# Altium schematic sheet FMB-MCU.SchDoc
size A3
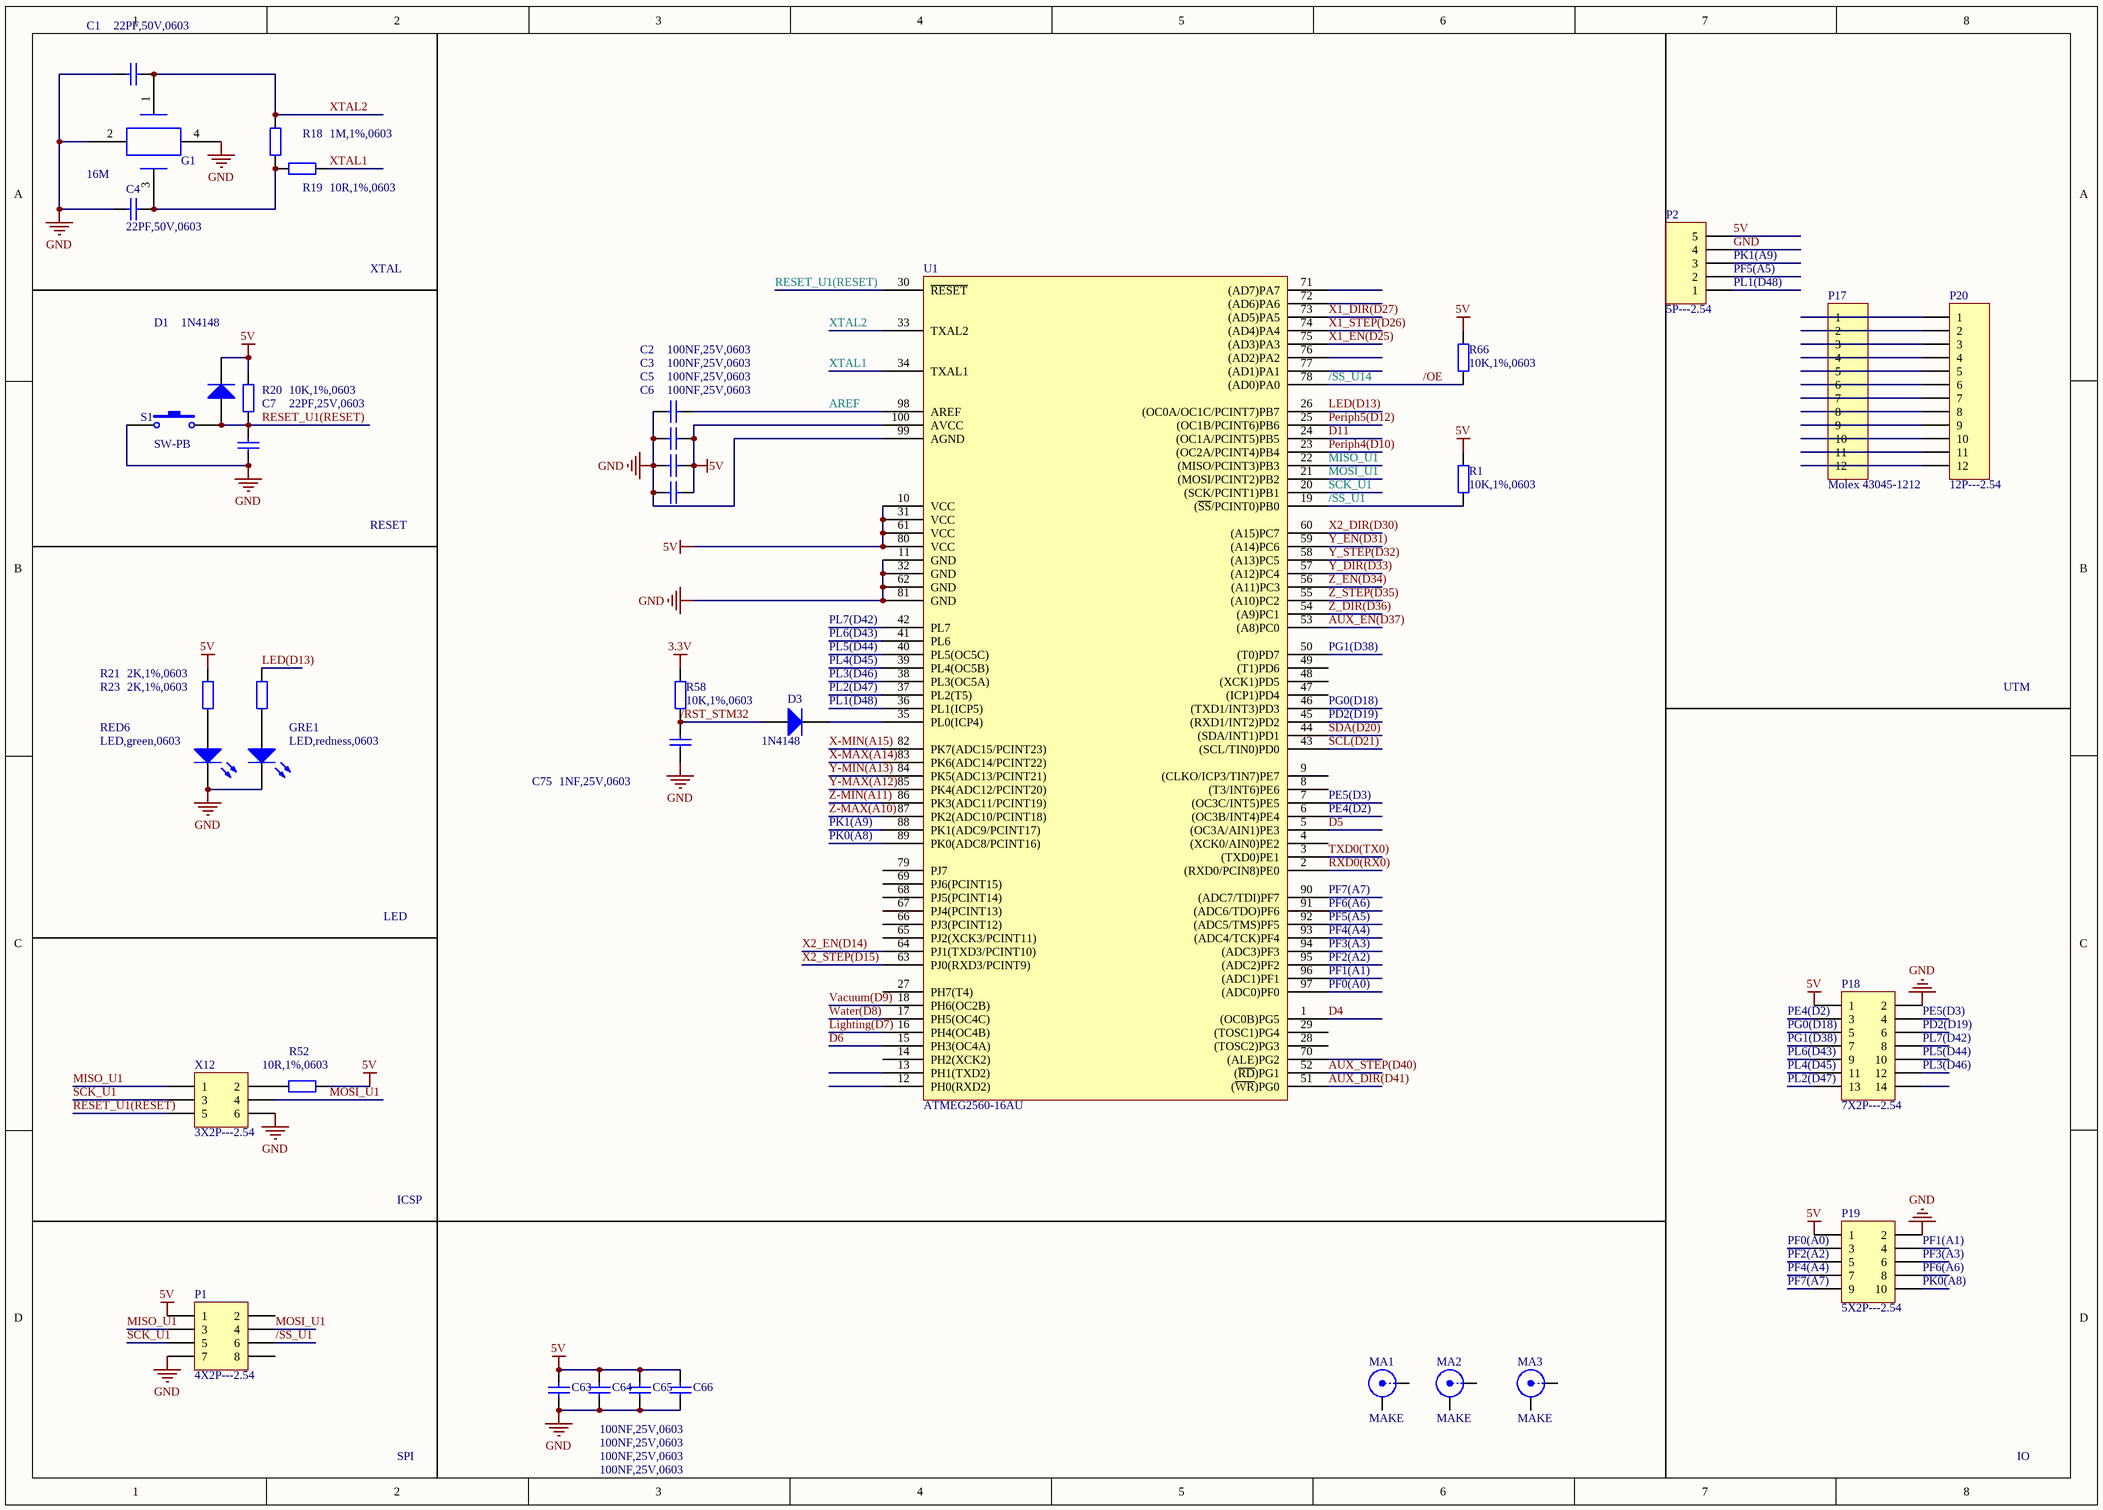
[diagram p0: FMB-MCU.SchDoc]

## Parts
C1  22PF,50V,0603  [RC0603]
C2  100NF,25V,0603  [RC0603]
C3  100NF,25V,0603  [RC0603]
C4  22PF,50V,0603  [RC0603]
C5  100NF,25V,0603  [RC0603]
C6  100NF,25V,0603  [RC0603]
C7  22PF,25V,0603  [RC0603]
C63  100NF,25V,0603  [RC0603]
C64  100NF,25V,0603  [RC0603]
C65  100NF,25V,0603  [RC0603]
C66  100NF,25V,0603  [RC0603]
C75  1NF,25V,0603  [RC0603]
D1  1N4148  [SOD-323]
D3  1N4148  [SOD-323]
G1  16M  [Y-3225]
GRE1  LED,redness,0603  [LED-0603]
MA1  MAKE
MA2  MAKE
MA3  MAKE
P1  4X2P---2.54  [HDR2X4]
P2  5P---2.54  [HDR1X5]
P17  Molex 43045-1212  [43045-1212]
P18  7X2P---2.54  [HDR2X7]
P19  5X2P---2.54  [HDR2X5]
P20  12P---2.54  [HDR1X12]
R1  10K,1%,0603  [RC0603]
R18  1M,1%,0603  [RC0603]
R19  10R,1%,0603  [RC0603]
R20  10K,1%,0603  [RC0603]
R21  2K,1%,0603  [RC0603]
R23  2K,1%,0603  [RC0603]
R52  10R,1%,0603  [RC0603]
R58  10K,1%,0603  [RC0603]
R66  10K,1%,0603  [RC0603]
RED6  LED,green,0603  [LED-0603]
S1  SW-PB  [DIP6*6]
U1  ATMEG2560-16AU  [LQFP-100]
X12  3X2P---2.54  [HDR2X3]

## Nets
3.3V: R58.1
5V: C3.1 C5.1 C6.1 C63.1 C64.1 C65.1 C66.1 D1.2(K) P1.1 P2.5 P18.1 P19.1 R1.2 R20.1 R23.1 R52.1 R66.2 U1.10(VCC) U1.31(VCC) U1.61(VCC) U1.80(VCC) U1.100(AVCC)
GND: C1.2 C2.2 C3.2 C4.1 C5.2 C6.2 C7.2 C63.2 C64.2 C65.2 C66.2 C75.1 G1.2 G1.4 GRE1.2(K) P1.7 P2.4 P18.2 P19.2 RED6.2(K) S1.1 U1.11(GND) U1.32(GND) U1.62(GND) U1.81(GND) U1.99(AGND) X12.6
/OE: R66.1 U1.78((AD0)PA0)  [also labelled /SS_U14]
/RST_STM32: C75.2 D3.1(A) R58.2
/SS_U1: P1.6 R1.1 U1.19((~{SS}/PCINT0)PB0)
AREF: C2.1 U1.98(AREF)
AUX_DIR(D41): U1.51((~{WR})PG0)
AUX_EN(D37): U1.53((A8)PC0)
AUX_STEP(D40): U1.52((~{RD})PG1)
D4: U1.1((OC0B)PG5)
D5: U1.5((OC3A/AIN1)PE3)
D6: U1.15(PH3(OC4A))
D11: U1.24((OC1A/PCINT5)PB5)
LED(D13): R21.1 U1.26((OC0A/OC1C/PCINT7)PB7)
Lighting(D7): U1.16(PH4(OC4B))
MISO_U1: P1.3 U1.22((MISO/PCINT3)PB3) X12.1
MOSI_U1: P1.4 U1.21((MOSI/PCINT2)PB2) X12.4
PD2(D19): P18.6 U1.45((RXD1/INT2)PD2)
PE4(D2): P18.3 U1.6((OC3B/INT4)PE4)
PE5(D3): P18.4 U1.7((OC3C/INT5)PE5)
Periph4(D10): U1.23((OC2A/PCINT4)PB4)
Periph5(D12): U1.25((OC1B/PCINT6)PB6)
PF0(A0): P19.3 U1.97((ADC0)PF0)
PF1(A1): P19.4 U1.96((ADC1)PF1)
PF2(A2): P19.5 U1.95((ADC2)PF2)
PF3(A3): P19.6 U1.94((ADC3)PF3)
PF4(A4): P19.7 U1.93((ADC4/TCK)PF4)
PF5(A5): P2.2 U1.92((ADC5/TMS)PF5)
PF6(A6): P19.8 U1.91((ADC6/TDO)PF6)
PF7(A7): P19.9 U1.90((ADC7/TDI)PF7)
PG0(D18): P18.5 U1.46((TXD1/INT3)PD3)
PG1(D38): P18.7 U1.50((T0)PD7)
PK0(A8): P19.10 U1.89(PK0(ADC8/PCINT16))
PK1(A9): P2.3 U1.88(PK1(ADC9/PCINT17))
PL1(D48): P2.1 U1.36(PL1(ICP5))
PL2(D47): P18.13 U1.37(PL2(T5))
PL3(D46): P18.12 U1.38(PL3(OC5A))
PL4(D45): P18.11 U1.39(PL4(OC5B))
PL5(D44): P18.10 U1.40(PL5(OC5C))
PL6(D43): P18.9 U1.41(PL6)
PL7(D42): P18.8 U1.42(PL7)
RESET_U1(RESET): C7.1 D1.1(A) R20.2 S1.2 U1.30(~{RESET}) X12.5
RXD0(RX0): U1.2((RXD0/PCIN8)PE0)
SCK_U1: P1.5 U1.20((SCK/PCINT1)PB1) X12.3
SCL(D21): U1.43((SCL/TIN0)PD0)
SDA(D20): U1.44((SDA/INT1)PD1)
TXD0(TX0): U1.3((TXD0)PE1)
Vacuum(D9): U1.18(PH6(OC2B))
Water(D8): U1.17(PH5(OC4C))
X1_DIR(D27): U1.73((AD5)PA5)
X1_EN(D25): U1.75((AD3)PA3)
X1_STEP(D26): U1.74((AD4)PA4)
X2_DIR(D30): U1.60((A15)PC7)
X2_EN(D14): U1.64(PJ1(TXD3/PCINT10))
X2_STEP(D15): U1.63(PJ0(RXD3/PCINT9))
X-MAX(A14): U1.83(PK6(ADC14/PCINT22))
X-MIN(A15): U1.82(PK7(ADC15/PCINT23))
XTAL1: R19.2 U1.34(TXAL1)
XTAL2: C1.1 G1.1 R18.1 U1.33(TXAL2)
Y-MAX(A12): U1.85(PK4(ADC12/PCINT20))
Y-MIN(A13): U1.84(PK5(ADC13/PCINT21))
Y_DIR(D33): U1.57((A12)PC4)
Y_EN(D31): U1.59((A14)PC6)
Y_STEP(D32): U1.58((A13)PC5)
Z-MAX(A10): U1.87(PK2(ADC10/PCINT18))
Z-MIN(A11): U1.86(PK3(ADC11/PCINT19))
Z_DIR(D36): U1.54((A9)PC1)
Z_EN(D34): U1.56((A11)PC3)
Z_STEP(D35): U1.55((A10)PC2)
NetC4_2: C4.2 G1.3 R18.2 R19.1
NetD3_2: D3.2(K) U1.35(PL0(ICP4))
NetGRE1_1: GRE1.1(A) R21.2
NetP17_1: P17.1 P20.1
NetP17_2: P17.2 P20.2
NetP17_3: P17.3 P20.3
NetP17_4: P17.4 P20.4
NetP17_5: P17.5 P20.5
NetP17_6: P17.6 P20.6
NetP17_7: P17.7 P20.7
NetP17_8: P17.8 P20.8
NetP17_9: P17.9 P20.9
NetP17_10: P17.10 P20.10
NetP17_11: P17.11 P20.11
NetP17_12: P17.12 P20.12
NetR23_2: R23.2 RED6.1(A)
NetR52_2: R52.2 X12.2

Not connected (* = marked no-connect by the designer): MA1 1(X) 2(Y); MA2 1(X) 2(Y); MA3 1(X) 2(Y); P1 2 8; P18 14; U1 4((XCK0/AIN0)PE2) 8((T3/INT6)PE6) 9((CLKO/ICP3/TIN7)PE7) 12(PH0(RXD2)) 13(PH1(TXD2)) 14(PH2(XCK2)) 27(PH7(T4)) 28((TOSC2)PG3) 29((TOSC1)PG4) 47((ICP1)PD4) 48((XCK1)PD5) 49((T1)PD6) 65(PJ2(XCK3/PCINT11)) 66(PJ3(PCINT12)) 67(PJ4(PCINT13)) 68(PJ5(PCINT14)) 69(PJ6(PCINT15)) 70((ALE)PG2) 71((AD7)PA7) 72((AD6)PA6) 76((AD2)PA2) 77((AD1)PA1) 79(PJ7)

## Notes on the sheet
- XTAL
- RESET
- UTM
- LED
- ICSP
- SPI
- IO

## Library data of the parts
C1-C7 C63-C66 C75 = Cap: Capacitor; Value: 100pF; Published: 8-Jun-2000; LatestRevisionDate: 17-Jul-2002; LatestRevisionNote: Re-released for DXP Platform.; PackageReference: RAD-0.3; Publisher: Altium Limited; PackageDescription: Radial Cap, Thru-Hole; 2 Leads; 0.3 in Pin Spacing
D1 D3 = Diode: Default Diode; Published: 8-Jun-2000; LatestRevisionDate: 17-Jul-2002; LatestRevisionNote: Re-released for DXP Platform.; PackageVersion: Sep-1996; PackageReference: SMC; Publisher: Altium Limited; PackageDescription: DO-214-AB/SMC; 2 C-Bend Leads; Body 7.9 x 5.9 mm, inc. leads (LxW); Code_JEDEC: DO-214-AB
G1 = G
GRE1 RED6 = LED0: Typical INFRARED GaAs LED; Published: 8-Jun-2000; LatestRevisionDate: 08-Jul-2005; LatestRevisionNote: Mech Layer 1 removed.; PackageReference: LED-0; Publisher: Altium Limited; PackageDescription: LED; 2 Leads
MA1-MA3 = BNC: BNC Elbow Connector; LatestRevisionDate: 17-Jul-2002; LatestRevisionNote: Re-released for DXP Platform.; Publisher: Altium Limited
P1 = Header 4X2: Header, 4-Pin, Dual row; LatestRevisionDate: 17-Jul-2002; LatestRevisionNote: Re-released for DXP Platform.; Publisher: Altium Limited
P2 = Header 5: Header, 5-Pin; LatestRevisionDate: 17-Jul-2002; LatestRevisionNote: Re-released for DXP Platform.; Publisher: Altium Limited
P17 P20 = Header 12: Header, 12-Pin; LatestRevisionDate: 17-Jul-2002; LatestRevisionNote: Re-released for DXP Platform.; Publisher: Altium Limited
P18 = Header 7X2: Header, 7-Pin, Dual row; LatestRevisionDate: 17-Jul-2002; LatestRevisionNote: Re-released for DXP Platform.; Publisher: Altium Limited
P19 = Header 5X2: Header, 5-Pin, Dual row; LatestRevisionDate: 17-Jul-2002; LatestRevisionNote: Re-released for DXP Platform.; Publisher: Altium Limited
R1 R18-R21 R23 R52 R58 R66 = Res2: Resistor; Value: 1K; Published: 8-Jun-2000; LatestRevisionDate: 17-Jul-2002; LatestRevisionNote: Re-released for DXP Platform.; PackageReference: AXIAL-0.4; Publisher: Altium Limited; PackageDescription: Axial Device, Thru-Hole; 2 Leads; 0.4 in Pin Spacing
S1 = SW-PB: Switch; Published: 24-Mar-1999; LatestRevisionDate: 17-Jul-2002; LatestRevisionNote: Re-released for DXP Platform.; PackageReference: SPST-2; Publisher: Altium Limited; PackageDescription: Switch; 2 Leads
X12 = Header 3X2: Header, 3-Pin, Dual row; LatestRevisionDate: 17-Jul-2002; LatestRevisionNote: Re-released for DXP Platform.; Publisher: Altium Limited